# EAGLE design brushless (EAGLE 4.16)
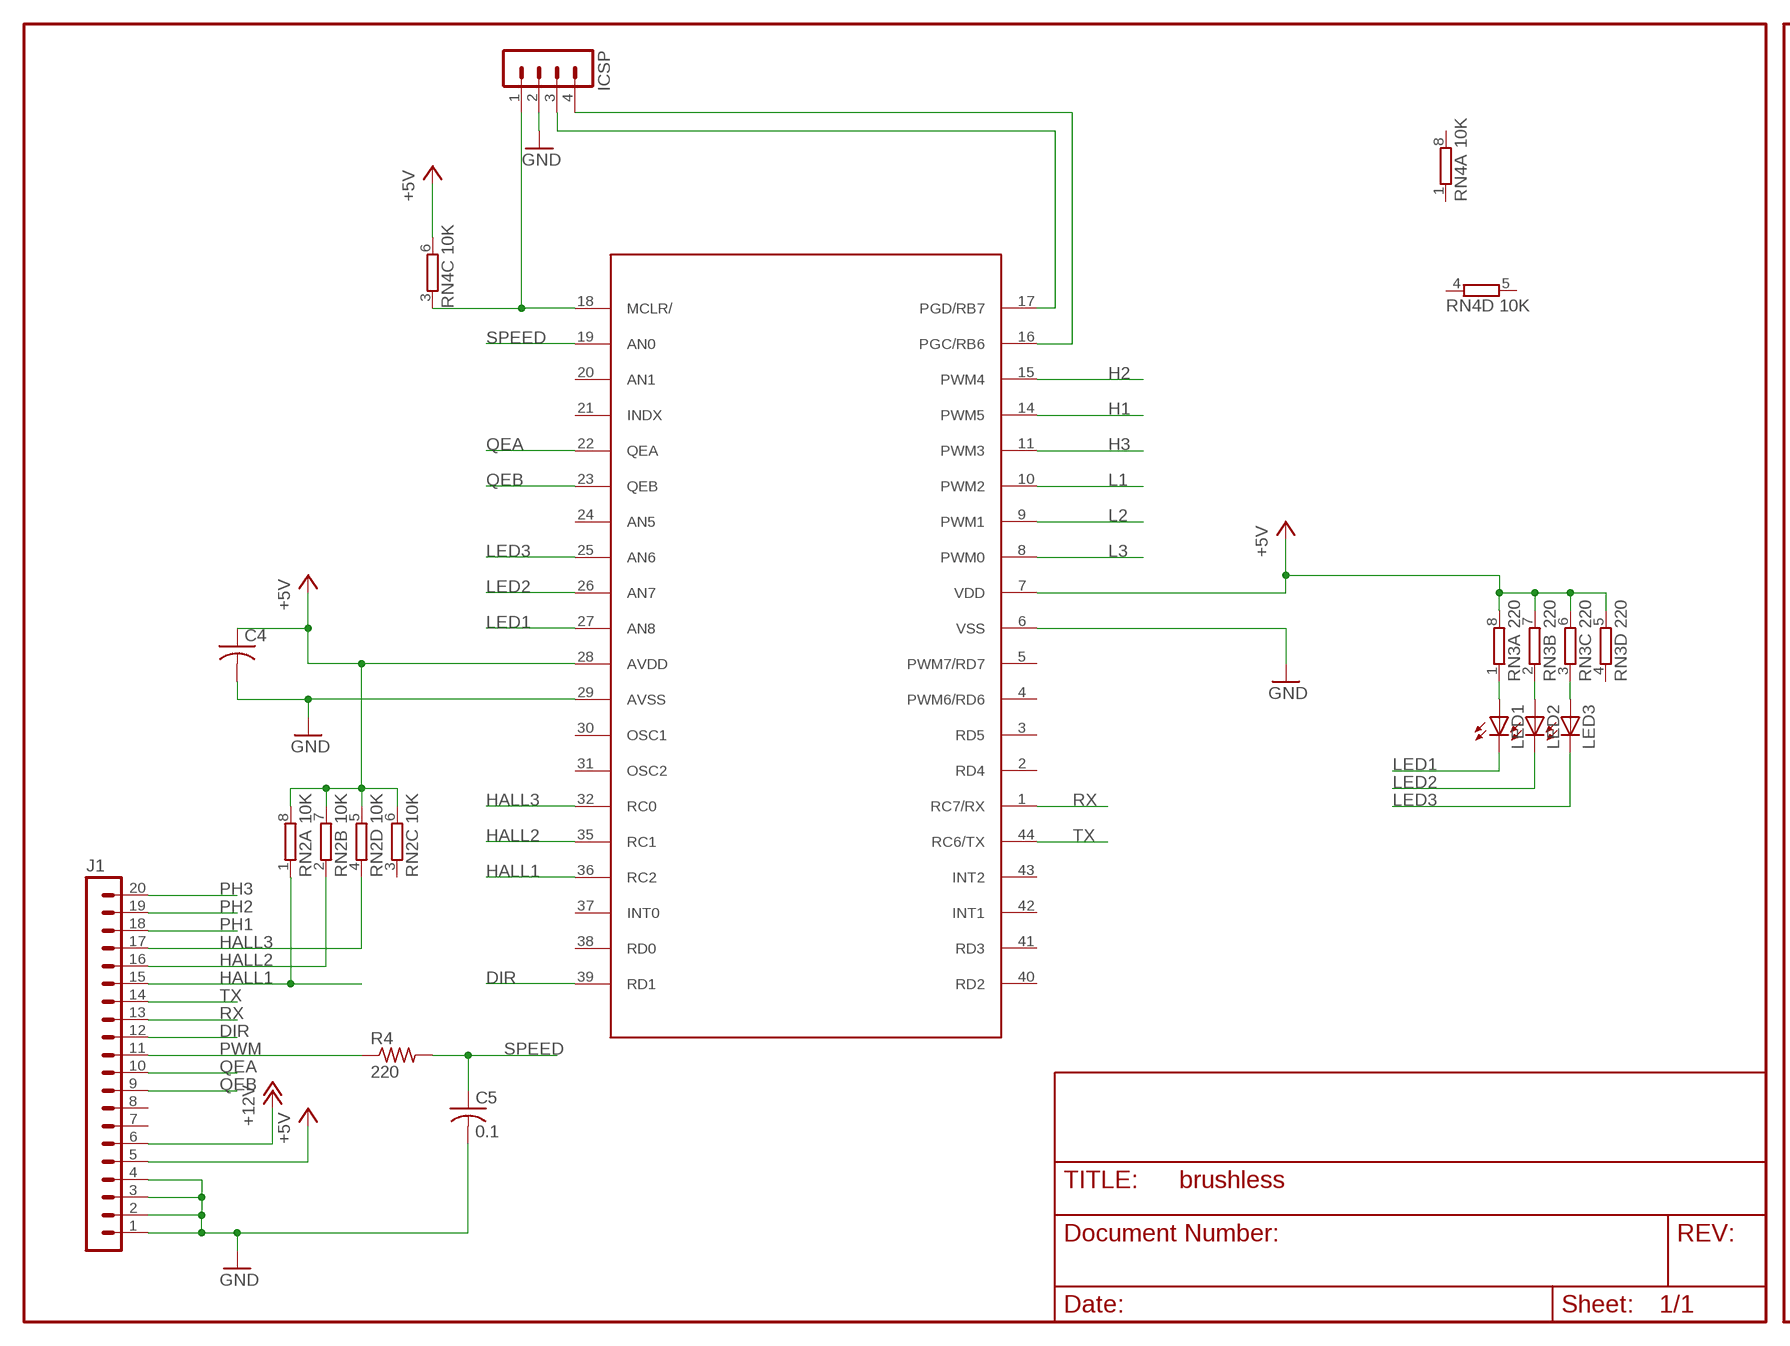
[diagram p0: schematic, sheet 1, part 1 of 2]
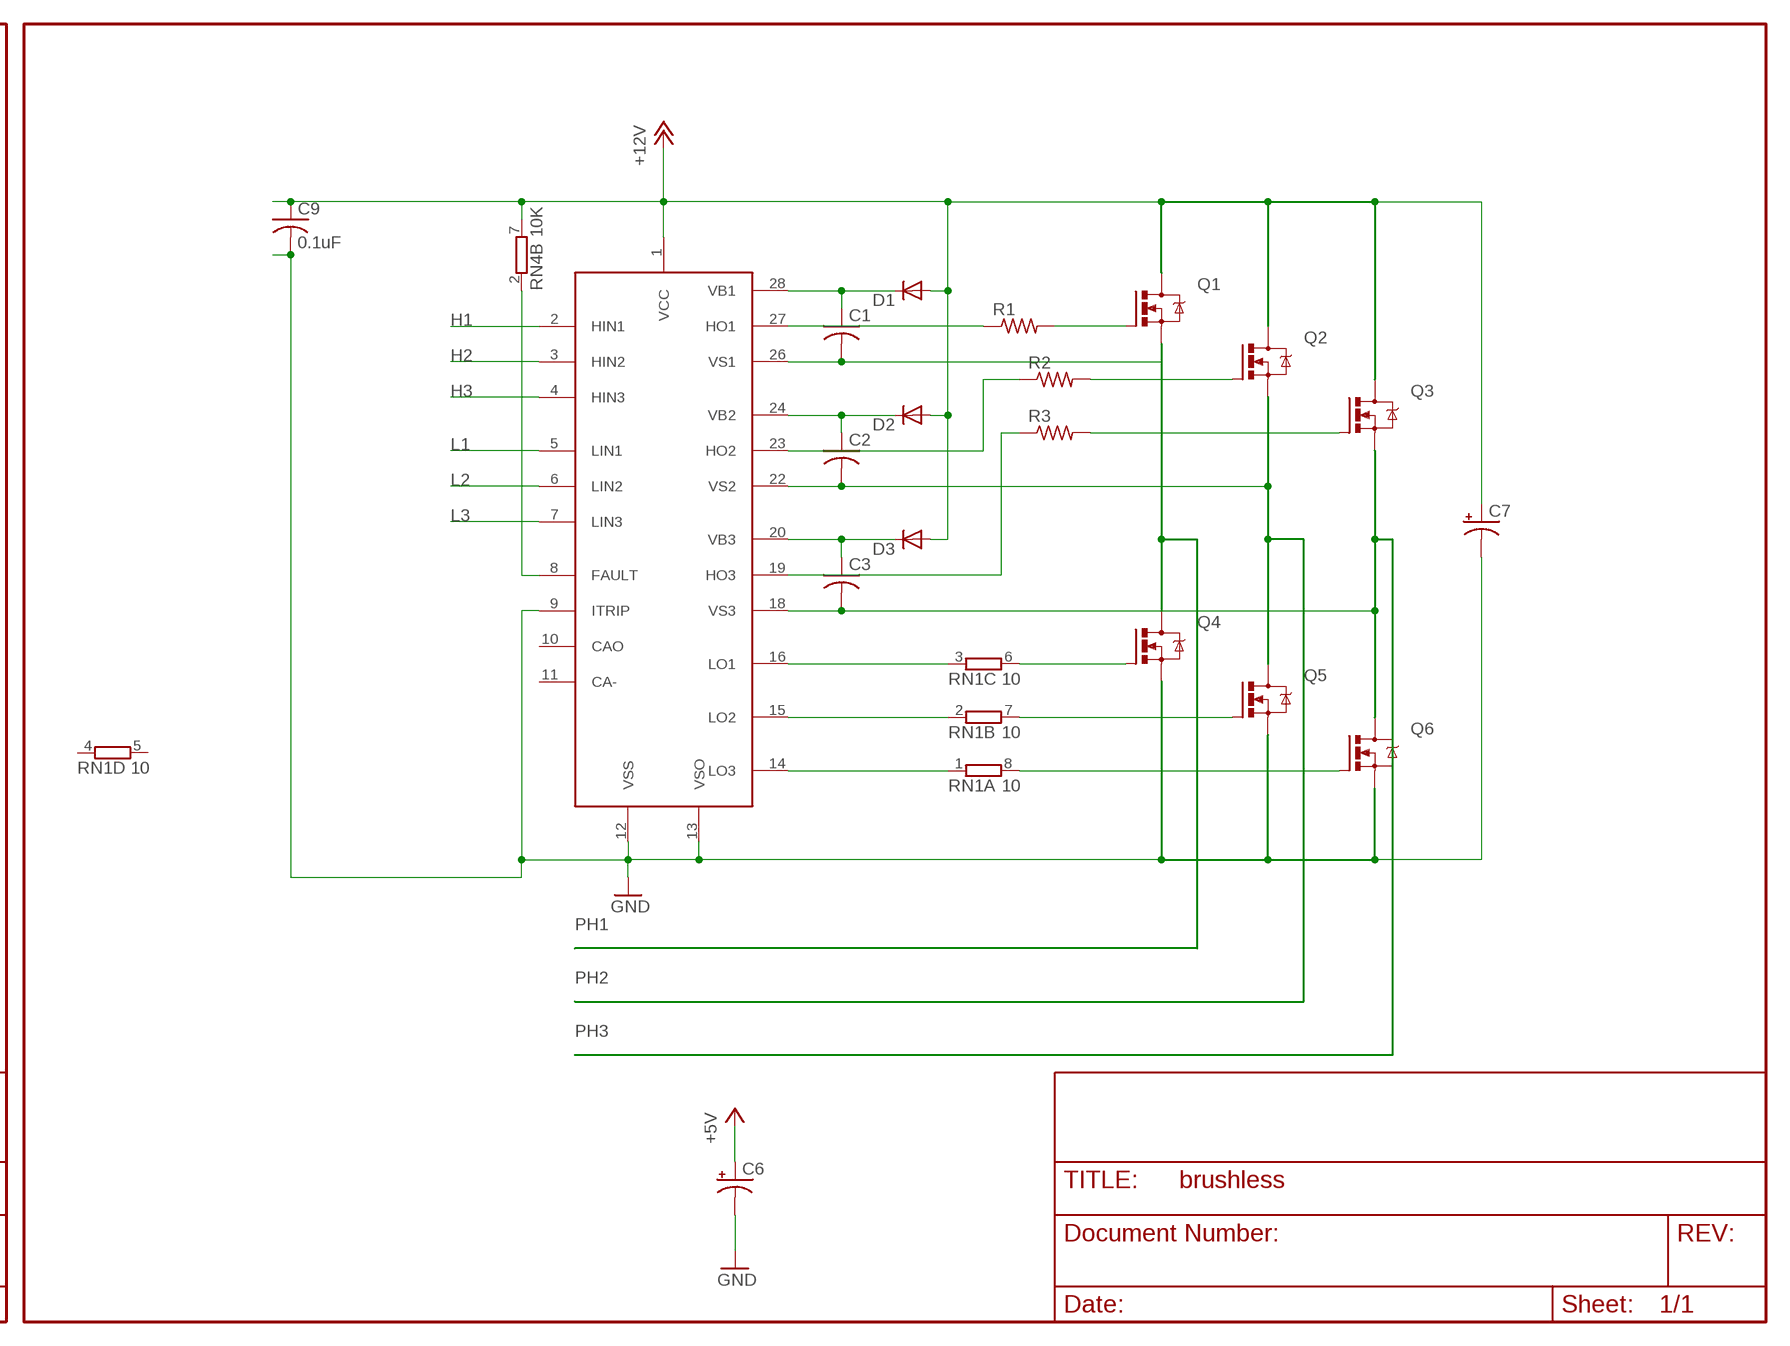
[diagram p1: schematic, sheet 1, part 2 of 2]

## Parts
C1  C-USC0805  [C0805]
C2  C-USC0805  [C0805]
C3  C-USC0805  [C0805]
C4  C-USC0805  [C0805]
C5  0.1  C-USC0805  [C0805]
C6  CPOL-USE2.5-5  [E2,5-5]
C7  CPOL-USE2.5-5  [E2,5-5]
C9  0.1uF  C-USC0805  [C0805]
D1  DIODE-MINIMELF  [MINIMELF]
D2  DIODE-MINIMELF  [MINIMELF]
D3  DIODE-MINIMELF  [MINIMELF]
IC1  PIC18F4431S  [TQFP44]
IC2  IR2130S  [SOP28]
ICSP  MA04-1  [MA04-1]
J1  MA20-1W  [MA20-1W]
LED1  LEDCHIPLED_0805  [CHIPLED_0805]
LED2  LEDCHIPLED_0805  [CHIPLED_0805]
LED3  LEDCHIPLED_0805  [CHIPLED_0805]
Q1  IRF520  [TO220BV]
Q2  IRF520  [TO220BV]
Q3  IRF520  [TO220BV]
Q4  IRF520  [TO220BV]
Q5  IRF520  [TO220BV]
Q6  IRF520  [TO220BV]
R1  R-US_R0805  [R0805]
R2  R-US_R0805  [R0805]
R3  R-US_R0805  [R0805]
R4  220  R-US_R0805  [R0805]
RN1  10  4R-N0603-ARC  [0603-ARC]
RN2  10K  4R-N0603-ARC  [0603-ARC]
RN3  220  4R-N0603-ARC  [0603-ARC]
RN4  10K  4R-N0603-ARC  [0603-ARC]

## Nets
+5V: C4.1 C6.+ IC1.7(VDD) IC1.28(AVDD) J1.5 RN2.5 RN2.6 RN2.7 RN2.8 RN3.5 RN3.6 RN3.7 RN3.8 RN4.6
+12V: C7.+ C9.1 D1.A D2.A D3.A IC2.1(VCC) J1.6 Q1.D Q2.D Q3.D RN4.7
DIR: IC1.39(RD1) J1.12
GND: C4.2 C5.2 C6.- C7.- C9.2 IC1.6(VSS) IC1.29(AVSS) IC2.9(ITRIP) IC2.12(VSS) IC2.13(VSO) ICSP.2 J1.1 J1.2 J1.3 J1.4 Q4.S Q5.S Q6.S
H1: IC1.14(PWM5) IC2.2(HIN1)
H2: IC1.15(PWM4) IC2.3(HIN2)
H3: IC1.11(PWM3) IC2.4(HIN3)
HALL1: IC1.36(RC2) J1.15 RN2.1
HALL2: IC1.35(RC1) J1.16 RN2.2
HALL3: IC1.32(RC0) J1.17 RN2.4
L1: IC1.10(PWM2) IC2.5(LIN1)
L2: IC1.9(PWM1) IC2.6(LIN2)
L3: IC1.8(PWM0) IC2.7(LIN3)
LED1: IC1.27(AN8) LED1.C
LED2: IC1.26(AN7) LED2.C
LED3: IC1.25(AN6) LED3.C
N$1: IC2.27(HO1) R1.1
N$2: LED2.A RN3.2
N$3: LED3.A RN3.3
N$4: C1.1 D1.C IC2.28(VB1)
N$5: C2.1 D2.C IC2.24(VB2)
N$6: Q1.G R1.2
N$7: C3.1 D3.C IC2.20(VB3)
N$8: LED1.A RN3.1
N$9: IC1.18(MCLR/) ICSP.1 RN4.3
N$12: IC2.16(LO1) RN1.3
N$13: Q4.G RN1.6
N$14: IC2.15(LO2) RN1.2
N$15: IC2.14(LO3) RN1.1
N$16: Q5.G RN1.7
N$17: Q6.G RN1.8
N$18: IC2.23(HO2) R2.1
N$19: Q2.G R2.2
N$20: Q3.G R3.2
N$21: IC2.19(HO3) R3.1
N$22: IC1.17(PGD/RB7) ICSP.3
N$23: IC1.16(PGC/RB6) ICSP.4
N$31: IC2.8(FAULT) RN4.2
PH1: C1.2 IC2.26(VS1) J1.18 Q1.S Q4.D
PH2: C2.2 IC2.22(VS2) J1.19 Q2.S Q5.D
PH3: C3.2 IC2.18(VS3) J1.20 Q3.S Q6.D
PWM: J1.11 R4.1
QEA: IC1.22(QEA) J1.10
QEB: IC1.23(QEB) J1.9
RX: IC1.1(RC7/RX) J1.13
SPEED: C5.1 IC1.19(AN0) R4.2
TX: IC1.44(RC6/TX) J1.14
Unconnected: IC1.2(RD4) IC1.3(RD5) IC1.4(PWM6/RD6) IC1.5(PWM7/RD7) IC1.20(AN1) IC1.21(INDX) IC1.24(AN5) IC1.30(OSC1) IC1.31(OSC2) IC1.37(INT0) IC1.38(RD0) IC1.40(RD2) IC1.41(RD3) IC1.42(INT1) IC1.43(INT2) IC2.10(CAO) IC2.11(CA-) J1.7 J1.8 RN1.4 RN1.5 RN2.3 RN3.4 RN4.1 RN4.4 RN4.5 RN4.8

## Library data of the parts
C1-C5 C9 = rcl:C-US: CAPACITOR, American symbol
C6 C7 = rcl:CPOL-US: POLARIZED CAPACITOR, American symbol
D1-D3 = diode:DIODE-: DIODE
IC1 = microchip:PIC18F4431
IC2 = transistor-fet:IR2130
ICSP = con-lstb:MA04-1: PIN HEADER
J1 = con-lstb:MA20-1W: PIN HEADER
LED1-LED3 = led:LED: LED OSRAM: - CHIPLED LG R971, LG N971, LY N971, LG Q971, LY Q971, LO R971, LY R971 LH N974, LH R974 LS Q976, LO Q976, LY Q976 LO Q996 - Hyper CHIPLED LW Q18S LB Q993, LB Q99A, LB R99A - SideLED LS A670, LO A670, LY A670, LG A670, LP A670 LB A673, LV A673, LT A673, LW A673 LH A674 LY A675 LS A676, LA A676, LO A676, LY A676, LW A676 LS A679, LY A679, LG A679 - Hyper Micro SIDELED® LS Y876, LA Y876, LO Y876, LY Y876 LT Y87S - SmartLED LW L88C, LW L88S LB L89C, LB L89S, LG L890 LS L89K, LO L89K, LY L89K LS L896, LA L896, LO L896, LY L896 - TOPLED LS T670, LO T670, LY T670, LG T670, LP T670 LSG T670, LSP T670, LSY T670, LOP T670, LYG T670 LG T671, LOG T671, LSG T671 LB T673, LV T673, LT T673, LW T673 LH T674 LS T676, LA T676, LO T676, LY T676, LB T676, LH T676, LSB T676, LW T676 LB T67C, LV T67C, LT T67C, LS T67K, LO T67K, LY T67K, LW E67C LS E67B, LA E67B, LO E67B, LY E67B, LB E67C, LV E67C, LT E67C LW T67C LS T679, LY T679, LG T679 LS T770, LO T770, LY T770, LG T770, LP T770 LB T773, LV T773, LT T773, LW T773 LH T774 LS E675, LA E675, LY E675, LS T675 LS T776, LA T776, LO T776, LY T776, LB T776 LHGB T686 LT T68C, LB T68C - Hyper Mini TOPLED® LB M676 - Mini TOPLED Santana® LG M470 LS M47K, LO M47K, LY M47K Source: http://www.osram.convergy.de - LUMILED® LXK2-PW12-R00, LXK2-PW12-S00, LXK2-PW14-U00, LXK2-PW14-V00 LXK2-PM12-R00, LXK2-PM12-S00, LXK2-PM14-U00 LXK2-PE12-Q00, LXK2-PE12-R00, LXK2-PE12-S00, LXK2-PE14-T00, LXK2-PE14-U00 LXK2-PB12-K00, LXK2-PB12-L00, LXK2-PB12-M00, LXK2-PB14-N00, LXK2-PB14-P00, LXK2-PB14-Q00 LXK2-PR12-L00, LXK2-PR12-M00, LXK2-PR14-Q00, LXK2-PR14-R00 LXK2-PD12-Q00, LXK2-PD12-R00, LXK2-PD12-S00 LXK2-PH12-R00, LXK2-PH12-S00 LXK2-PL12-P00, LXK2-PL12-Q00, LXK2-PL12-R00 Source: www.luxeon.com
Q1-Q6 = transistor-power:IRF520: HEXFET Power MOSFET
R1-R4 = rcl:R-US_: RESISTOR, American symbol
RN1-RN4 = resistor-dil:4R-N: Array Chip Resistor Source: RS Component / Phycomp

## Board
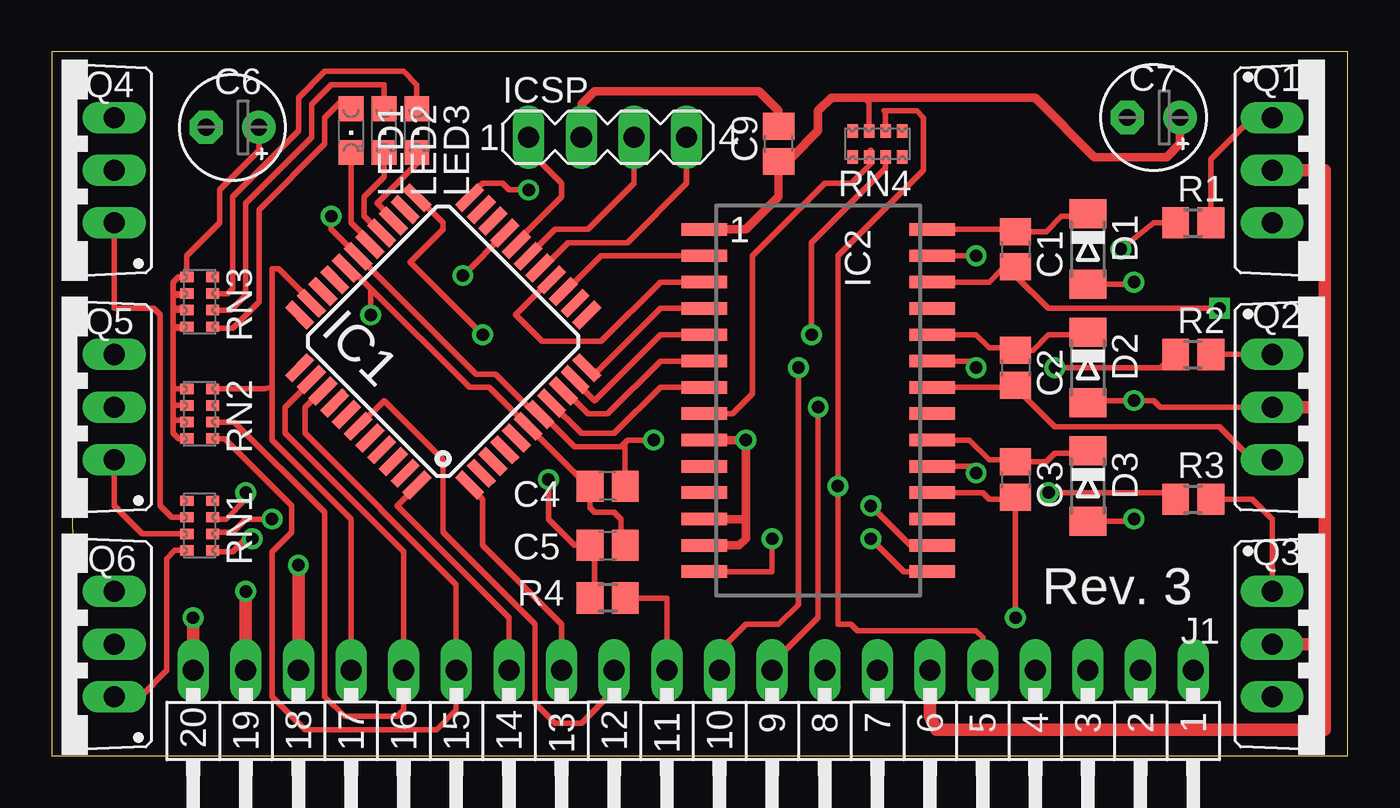
[diagram p2: board, top side]
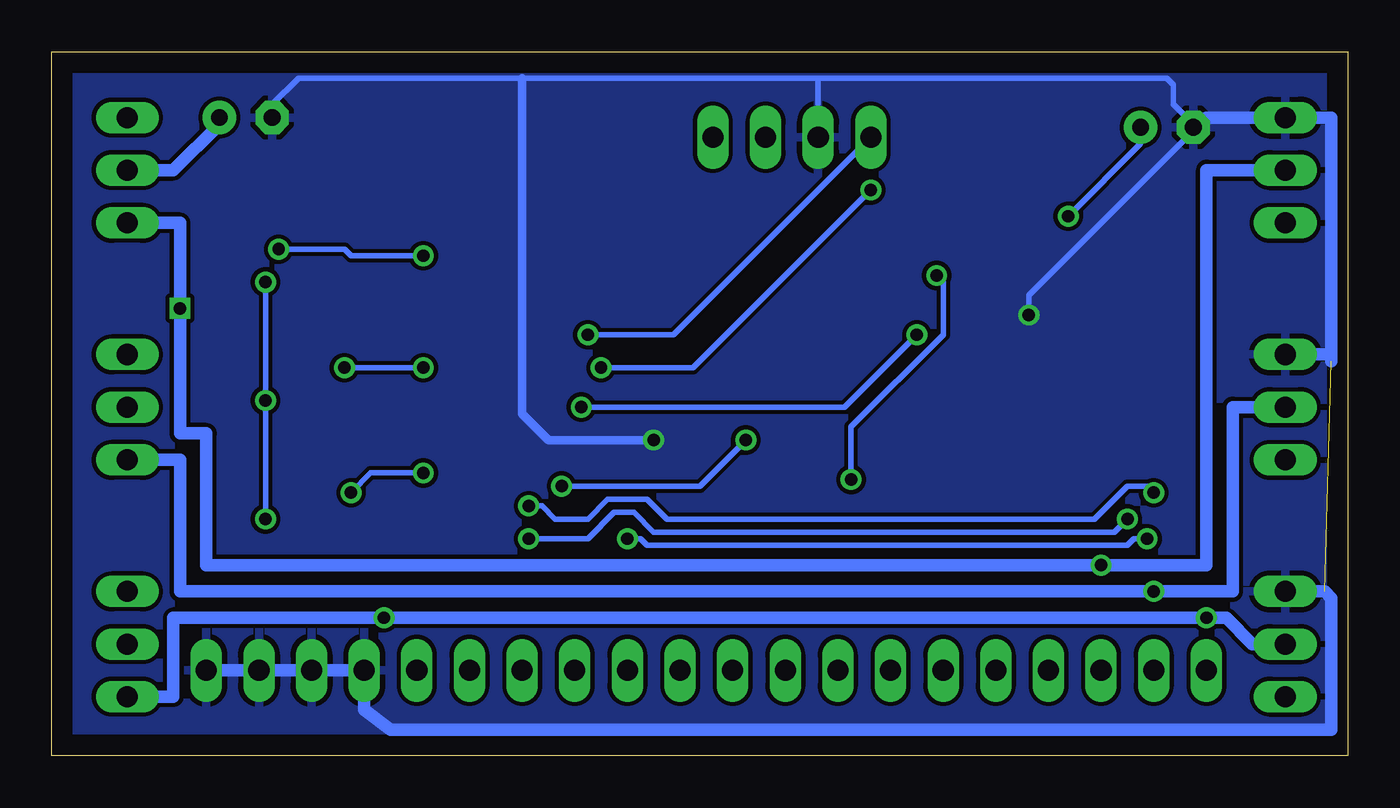
[diagram p3: board, bottom side, seen from below]

Size 62.54 x 33.96 mm. Coordinates in mm from the lower left corner, seen from the top.
Outline: 0,0 62.54,0 62.54,33.96 0,33.96 0,0
Copper layers (1*16): Top 0.035mm / dielectric 1.5mm / Bottom 0.035mm
Design rules "default": minimum track width 10mil, minimum drill 24mil, track to track 8mil, track to pad 8mil, pad to pad 8mil, via to via 8mil, smd to smd 8mil, copper to edge 40mil, drill to drill 8mil, minimum pad ring 10mil, minimum via ring 8mil, stop-mask expansion 4mil, vias tented up to drill 0mil, thermal gap 10mil

### Footprints (pad centres in the part's own frame; a part is rotated, then mirrored left to right if it is on the bottom)
C0805 = smd 1.3 x 1.5: 1 -0.85,0; 2 0.85,0
E2,5-5 = drill 0.813 pad 1.6 round: + -1.27,0 | drill 0.813 pad 1.6 octagon: - 1.27,0
MINIMELF = smd 1.4 x 1.8: A 1.7,0; C -1.7,0
TQFP44 = smd 1.5 x 0.5: 1 -5.8,4; 2 -5.8,3.2; 3 -5.8,2.4; 4 -5.8,1.6; 5 -5.8,0.8; 6 -5.8,0; 7 -5.8,-0.8; 8 -5.8,-1.6; 9 -5.8,-2.4; 10 -5.8,-3.2; 11 -5.8,-4; 23 5.8,-4; 24 5.8,-3.2; 25 5.8,-2.4; 26 5.8,-1.6; 27 5.8,-0.8; 28 5.8,0; 29 5.8,0.8; 30 5.8,1.6; 31 5.8,2.4; 32 5.8,3.2; 33 5.8,4 | smd 0.5 x 1.5: 12 -4,-5.8; 13 -3.2,-5.8; 14 -2.4,-5.8; 15 -1.6,-5.8; 16 -0.8,-5.8; 17 0,-5.8; 18 0.8,-5.8; 19 1.6,-5.8; 20 2.4,-5.8; 21 3.2,-5.8; 22 4,-5.8; 34 4,5.8; 35 3.2,5.8; 36 2.4,5.8; 37 1.6,5.8; 38 0.8,5.8; 39 0,5.8; 40 -0.8,5.8; 41 -1.6,5.8; 42 -2.4,5.8; 43 -3.2,5.8; 44 -4,5.8
SOP28 = smd 0.6 x 2.2: 1 -8.255,-5.5; 2 -6.985,-5.5; 3 -5.715,-5.5; 4 -4.445,-5.5; 5 -3.175,-5.5; 6 -1.905,-5.5; 7 -0.635,-5.5; 8 0.635,-5.5; 9 1.905,-5.5; 10 3.175,-5.5; 11 4.445,-5.5; 12 5.715,-5.5; 13 6.985,-5.5; 14 8.255,-5.5; 15 8.255,5.5; 16 6.985,5.5; 17 5.715,5.5; 18 4.445,5.5; 19 3.175,5.5; 20 1.905,5.5; 21 0.635,5.5; 22 -0.635,5.5; 23 -1.905,5.5; 24 -3.175,5.5; 25 -4.445,5.5; 26 -5.715,5.5; 27 -6.985,5.5; 28 -8.255,5.5
MA04-1 = drill 1.016 long: 1 -3.81,0; 2 -1.27,0; 3 1.27,0; 4 3.81,0
MA20-1W = drill 1.016 long: 1 -24.13,0; 2 -21.59,0; 3 -19.05,0; 4 -16.51,0; 5 -13.97,0; 6 -11.43,0; 7 -8.89,0; 8 -6.35,0; 9 -3.81,0; 10 -1.27,0; 11 1.27,0; 12 3.81,0; 13 6.35,0; 14 8.89,0; 15 11.43,0; 16 13.97,0; 17 16.51,0; 18 19.05,0; 19 21.59,0; 20 24.13,0
CHIPLED_0805 = smd 1.2 x 1.2: A 0,-1.05; C 0,1.05
TO220BV = drill 1.016 long: D 0,-2.54; G -2.54,-2.54; S 2.54,-2.54
R0805 = smd 1.3 x 1.5: 1 -0.85,0; 2 0.85,0
0603-ARC = smd 0.5 x 0.65: 1 -1.2,-0.625; 2 -0.4,-0.625; 3 0.4,-0.625; 4 1.2,-0.625; 5 1.2,0.625; 6 0.4,0.625; 7 -0.4,0.625; 8 -1.2,0.625

### Placement (x,y rotation side)
C1  46.51,24.44 270 top
C2  46.51,18.73 270 top
C3  46.51,13.33 270 top
C4  26.82,13.01 180 top
C5  26.82,10.15 0 top
C6  8.73,30.32 180 top
C7  53.18,30.79 180 top
C9  35.08,29.52 90 top
D1  50,24.44 270 top
D2  50,18.73 270 top
D3  50,13.01 270 top
IC1  18.89,20 135 top
IC2  36.98,17.14 270 top
ICSP  26.82,29.84 0 top
J1  30.95,4.12 180 top
LED1  14.44,30.16 180 top
LED2  16.03,30.16 180 top
LED3  17.61,30.16 180 top
Q1  61.43,28.25 270 top
Q2  61.43,16.82 270 top
Q3  61.43,5.39 270 top
Q4  0.47,28.25 90 top
Q5  0.47,16.82 90 top
Q6  0.47,5.39 90 top
R1  55.08,25.71 0 top
R2  55.08,19.36 0 top
R3  55.08,12.38 0 top
R4  26.82,7.62 180 top
RN1  7.14,11.11 90 top
RN2  7.14,16.5 90 top
RN3  7.14,21.9 90 top
RN4  39.84,29.52 0 top

### Tracks (layer width: path | path; a pad name or v marks a point on that pad's centre or on a via)
+5V  (via drill 0.6)
  Top 0.254: IC1.28 20.47,18.41 21.43,18.41 23.37,16.46 IC1.7 23.69,16.46 25.23,14.92 27.46,14.92 27.77,15.23 | 27.77,15.23 v29.04,15.23 | J1.5 44.92,5.71 44.6,6.03 38.89,6.03 38.57,6.35 37.93,6.35 v37.93,13.01 37.93,24.13 42.06,28.25 42.06,30.79 41.75,31.11 40.16,31.11 40.24,31.03 RN4.6 | RN2.8 6.12,15.3 5.87,15.55 5.87,16.19 | RN2.7 6.51,16.18 6.5,16.19 5.87,16.19 | 5.87,17.7 RN2.5 | 5.87,16.82 5.87,16.19 | 5.87,16.82 5.87,17.7 | 5.87,17.7 5.87,20.7 RN3.8 6.5,20.63 5.87,20.63 5.87,21.5 RN3.7 6.5,21.58 5.87,21.58 5.87,22.3 RN3.6 6.51,22.23 6.5,22.22 5.87,22.22 5.87,22.85 6.12,23.1 RN3.5 6.51,24.13 8.09,25.71 8.09,27.3 9.99,29.2 9.99,30.16 10,30.16 C6.+ | IC1.28 | v13.49,26.03 13.49,25.4 IC1.28 | C4.1 27.67,15.13 27.77,15.23 | RN2.6 5.95,16.9 5.87,16.82
  Bottom 0.254: v37.93,13.01 31.27,13.01 v29.04,15.23 | C6.+ 10,29.52 v13.49,26.03
+12V  (via drill 0.6)
  Top 0.254: D1.A 52.43,22.74 v52.22,22.85 | D2.A 50,17.14 v52.22,17.14 53.18,17.14 53.49,16.82 Q2.D | D3.A 52.43,11.31 v52.22,11.43 | RN4.7 39.44,31.51 39.21,31.75
  Top 0.406: C7.+ 54.44,29.52 53.81,28.89 50.32,28.89 47.46,31.75 39.21,31.75 37.62,31.75 36.98,31.11 36.98,30.16 35.71,28.89 35.08,28.89 C9.1 35.08,26.98 33.49,25.4 IC2.1
  Top 0.61: 61.43,5.39 61.43,1.26 42.7,1.26 42.38,1.9 J1.6 | 61.43,5.39 Q3.D | 61.43,16.82 Q2.D | 61.43,5.39 61.43,16.82 | Q1.D 61.43,28.25 61.43,16.82
  Bottom 0.254: v52.22,22.85 v52.22,17.14 v52.22,11.43
  Bottom 0.61: C7.+ 54.44,30.47 56.67,28.25 Q1.D
DIR
  Top 0.254: J1.12 27.14,3.17 25.55,1.58 24.28,1.58 23.33,2.53 23.33,6.35 18.89,10.79 18.89,14.28 16.03,17.14 IC1.39 14.76,15.87
GND  (via drill 0.6)  (1 unrouted)
  Top 0.254: 15.39,22.54 20.16,17.78 21.11,17.78 22.7,16.19 | IC1.6 23.01,15.87 22.7,16.19 | IC1.29 14.4,23.53 15.39,22.54 | v15.39,21.27 15.39,22.54 | 27.77,10.15 C5.2 27.46,10.15 27.46,11.43 27.14,11.74 26.19,11.74 25.97,11.96 C4.2 25.87,13.01 22.7,16.19 | 22.7,16.19 IC1.6 | IC1.6
  Top 0.406: ICSP.2 25.55,31.43 26.19,32.06 34.12,32.06 35.08,31.11 C9.2 | v33.49,15.23 IC2.9 v33.49,15.23 | v33.49,15.23 33.49,11.43 | 33.49,11.43 IC2.12 | IC2.13 33.17,10.15 33.49,10.47 33.49,11.43
  Bottom 0.254: v15.39,21.27 15.39,22.22 7.46,30.16 | C7.- 51.9,31.43 50.64,32.7 39.84,32.7 25.55,32.7 | 25.55,32.7 ICSP.2 | 25.55,32.7 8.72,32.7 8.41,32.38 8.41,31.43 7.46,30.47 | 7.46,30.47 | C6.- 7.46,30.47
  Bottom 0.406: v33.49,15.23 38.57,15.23 39.84,16.51 39.84,32.7
  Bottom 0.61: J1.1 J1.2 J1.3 J1.4 47.46,2.22 46.19,1.26 0.79,1.26 0.79,7.62 1.11,7.93 Q6.S | 0.79,19.36 0.79,19.04 | 0.79,19.36 Q5.S | 0.79,19.36 0.79,30.79 Q4.S 6.82,30.79 7.46,30.16 | 7.46,30.16 | 7.46,30.16 C6.-
  pour Bottom: -4.29,-1.59 -4.29,35.87 67.46,35.87 67.46,-1.59
H1
  Top 0.254: IC1.14 24.78,22.4 26.5,24.13 IC2.2 31.59,24.13
H2
  Top 0.254: IC1.15 24.08,22.97 22.38,21.27 23.65,20 26.5,20 29.36,22.85 IC2.3
H3
  Top 0.254: IC1.11 26.13,18.35 29.36,21.58 IC2.4
HALL1
  Top 0.254: 13.09,17.69 13.17,17.78 | 13.09,17.69 IC1.36 | 13.09,17.69 12.22,16.82 12.22,15.55 19.52,8.25 J1.15 19.52,2.22 18.57,1.26 12.22,1.26 10.63,2.85 10.63,9.84 11.58,10.79 11.58,12.06 8.34,15.3 RN2.1
HALL2
  Top 0.254: IC1.35 12.52,18.11 12.54,18.09 11.27,16.82 11.27,15.55 16.98,9.84 J1.16 16.98,2.22 16.66,1.9 14.12,1.9 13.17,2.85 13.17,11.74 8.81,16.1 RN2.2
HALL3
  Top 0.254: J1.17 14.44,11.43 10.63,15.23 10.63,17.78 | 10.63,17.78 10.63,23.49 10.95,23.49 12.54,21.9 12.52,21.89 IC1.32 | RN2.4 10.24,17.7 10.63,17.78
L1
  Top 0.254: IC2.5 29.36,20.31 26.19,17.14 25.23,18.09 25.25,18.11 IC1.10
L2
  Top 0.254: IC1.9 24.78,17.59 25.87,16.51 26.82,16.51 29.36,19.04 IC2.6
L3
  Top 0.254: IC2.7 29.36,17.78 27.14,15.55 25.55,15.55 24.08,17.03 | 24.08,17.03 23.96,17.14 | IC1.8 24.08,17.03
LED1
  Top 0.254: IC1.27 15.35,24.8 14.44,25.71 LED1.C 14.44,29.2
LED2
  Top 0.254: IC1.26 15.88,25.23 15.07,26.03 15.07,26.98 16.03,27.94 LED2.C 16.03,29.2
LED3
  Top 0.254: IC1.25 16.48,25.89 15.71,26.67 17.61,28.57 LED3.C 17.61,29.2
N$1  (via drill 0.6)
  Top 0.254: IC2.27 v44.6,24.13 | v51.59,24.44 53.18,25.71 R1.1
  Bottom 0.254: v44.6,24.13 48.1,24.13 48.41,24.44 v51.59,24.44
N$2
  Top 0.254: RN3.2 8.64,21.5 9.36,22.22 9.36,26.67 12.54,29.84 12.54,31.43 13.49,32.38 16.03,32.38 LED2.A
N$3
  Top 0.254: RN3.3 8.49,22.3 8.72,22.54 8.72,26.98 11.9,30.16 11.9,31.75 13.17,33.01 16.98,33.01 17.61,32.38 LED3.A 17.61,31.11
N$4
  Top 0.254: IC2.28 46.51,25.4 C1.1 47.99,25.29 48.73,26.03 50,26.03 D1.C
N$5
  Top 0.254: IC2.24 44.6,20.31 45.24,19.68 46.51,19.68 C2.1 47.36,19.58 48.1,20.31 50,20.31 D2.C
N$6
  Top 0.254: R1.2 55.93,28.79 57.94,30.79 Q1.G
N$7
  Top 0.254: IC2.20 44.29,15.23 45.24,14.28 46.51,14.28 C3.1 47.99,14.18 48.41,14.6 49.68,14.6 49.79,14.71 D3.C
N$8
  Top 0.254: RN3.1 7.76,20.64 7.77,20.63 8.72,20.63 9.99,21.9 9.99,26.35 13.17,29.52 13.17,30.79 13.9,31.53 LED1.A
N$9  (via drill 0.6)
  Top 0.254: IC1.18 22.42,24.8 24.6,26.98 24.6,27.62 23.01,29.2 ICSP.1 | RN4.3 40.24,28.33 36.67,24.76 v36.67,20.31
  Bottom 0.254: v36.67,20.31 32.54,20.31 ICSP.1
N$12  (via drill 0.6)
  Top 0.254: IC2.16 41.43,10.15 v39.52,12.06 | v9.36,12.7 9.36,12.38 8.41,11.43 7.77,11.43 7.76,11.44 RN1.3
  Bottom 0.254: v39.52,12.06 38.89,12.06 38.25,11.43 36.67,11.43 35.71,12.38 33.81,12.38 32.86,11.43 12.22,11.43 10.63,13.01 9.68,13.01 v9.36,12.7
N$13
  Top 0.254: Q4.G 3.01,21.58 4.92,21.58 5.23,21.27 5.23,12.06 5.79,11.51 RN1.6
N$14  (via drill 0.6)
  Top 0.254: IC2.15 41.11,8.88 v39.52,10.47 | v10.63,11.43 9.36,11.43 8.72,10.79 7.77,10.79 7.76,10.78 RN1.2
  Bottom 0.254: v39.52,10.47 36.67,10.47 35.39,11.74 34.44,11.74 33.49,10.79 11.27,10.79 v10.63,11.43
N$15  (via drill 0.6)
  Top 0.254: IC2.14 34.76,8.88 v34.76,10.47 | v9.68,10.47 9.36,10.47 8.72,9.84 7.77,9.84 7.76,9.85 RN1.1
  Bottom 0.254: v34.76,10.47 34.12,10.47 33.81,10.15 10.63,10.15 10.31,10.47 v9.68,10.47
N$16
  Top 0.254: Q5.G 3.01,12.06 4.36,10.71 RN1.7
  Bottom 0.61: Q5.G 3.01,13.96
N$17
  Top 0.254: Q6.G 4.28,2.85 5.55,4.12 5.55,9.52 5.94,9.91 RN1.8
N$18  (via drill 0.6)
  Top 0.254: IC2.23 44.29,19.04 v44.6,18.73 | R2.1 54.13,19.36 53.49,18.73 v48.41,18.73
  Bottom 0.254: v44.6,18.73 v48.41,18.73
N$19
  Top 0.254: 55.71,19.36 R2.2 Q2.G
N$20
  Top 0.254: R3.2 57.94,12.38 58.89,11.43 Q3.G
N$21  (via drill 0.6)
  Top 0.254: IC2.19 44.29,13.96 v44.6,13.65 | R3.1 54.13,12.38 53.81,12.7 v48.1,12.7
  Bottom 0.254: v44.6,13.65 47.14,13.65 v48.1,12.7
N$22
  Top 0.254: IC1.17 24.28,25.4 25.87,25.4 28.09,27.62 ICSP.3
N$23
  Top 0.254: IC1.16 23.69,23.53 24.92,24.76 27.77,24.76 30.63,27.62 ICSP.4
N$31
  Top 0.254: IC2.8 32.86,16.51 33.81,17.46 33.81,24.13 37.3,27.62 38.57,27.62 39.52,28.57 39.52,29.2 39.51,29.22 RN4.2
PH1  (via drill 0.6)
  Top 0.254: IC2.26 45.24,22.85 45.87,23.49 46.51,23.49 C1.2 46.51,23.17 48.1,21.58 v56.35,21.58
  Top 0.61: J1.18 v11.9,9.2
  Bottom 0.61: Q4.D 6.82,28.25 6.82,9.2 v11.9,9.2 55.08,9.2 55.08,15.55 56.35,15.55 v56.35,21.58 56.35,25.71 Q1.S
PH2  (via drill 0.6)
  Top 0.254: 46.51,17.78 IC2.22 | 46.51,17.78 C2.2 | 46.51,17.78 48.41,15.87 56.35,15.87 57.94,14.28 Q2.S
  Top 0.61: J1.19 v9.36,7.93
  Bottom 0.61: Q5.D 5.55,16.82 5.55,7.93 v9.36,7.93 56.35,7.93 56.35,14.28 Q2.S
PH3  (via drill 0.6)
  Top 0.254: IC2.18 44.92,12.7 45.24,12.38 46.51,12.38 C3.2 v46.51,6.66
  Top 0.61: v6.82,6.66 J1.20
  Bottom 0.61: Q6.D 4.6,5.39 5.87,6.66 v6.82,6.66 v46.51,6.66 56.67,6.66 56.67,2.85 Q3.S
PWM
  Top 0.254: R4.1 29.68,7.62 J1.11
QEA  (via drill 0.6)
  Top 0.254: J1.10 32.22,5.07 33.49,6.35 35.08,6.35 36.03,7.3 v36.03,18.73 | v23.01,27.3 22.06,27.3 21.74,27.62 20.79,27.62 20.1,26.93 | 19.84,26.67 20.1,26.93 | 20.1,26.93 IC1.22
  Bottom 0.254: v36.03,18.73 31.59,18.73 v23.01,27.3
QEB  (via drill 0.6)
  Top 0.254: J1.9 34.76,4.44 36.98,6.66 v36.98,16.82 | v20.79,20.31 17.3,23.81 18.89,25.4 18.89,25.71 17.61,26.98 IC1.23
  Bottom 0.254: v36.98,16.82 24.28,16.82 v20.79,20.31
RX
  Top 0.254: IC1.1 20.16,13.01 20.79,12.38 20.79,10.15 24.6,6.35 J1.13 24.6,3.81
SPEED  (via drill 0.6)
  Top 0.254: R4.2 26.19,7.3 26.19,9.52 C5.1 25.23,10.15 23.96,11.43 v23.96,13.33 | 22.06,25.4 21.89,25.23 | 21.89,25.23 IC1.19 | v19.84,23.17 21.89,25.23
  Bottom 0.254: v23.96,13.33 23.96,15.87 19.52,20.31 19.52,22.85 v19.84,23.17
TX
  Top 0.254: IC1.44 17.61,13.01 16.66,12.06 22.06,6.66 J1.14

### Text on the board
tNames: Rev. 3